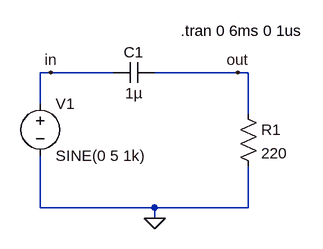
[diagram p0: schematic AC_Simulation.asc]
AC_Simulation.asc, the LTspice schematic file:
Version 4
SHEET 1 880 680
WIRE 96 112 80 112
WIRE 192 112 96 112
WIRE 384 112 256 112
WIRE 400 112 384 112
WIRE 80 160 80 112
WIRE 400 176 400 112
WIRE 80 320 80 240
WIRE 256 320 80 320
WIRE 400 320 400 256
WIRE 400 320 256 320
WIRE 256 336 256 320
FLAG 256 336 0
FLAG 96 112 in
FLAG 384 112 out
SYMBOL voltage 80 144 R0
WINDOW 123 0 0 Left 0
WINDOW 39 0 0 Left 0
SYMATTR InstName V1
SYMATTR Value SINE(0 5 1k)
SYMBOL cap 256 96 R90
WINDOW 0 0 32 VBottom 2
WINDOW 3 32 32 VTop 2
SYMATTR InstName C1
SYMATTR Value 1µ
SYMBOL res 384 160 R0
SYMATTR InstName R1
SYMATTR Value 220
TEXT 296 48 Left 2 !.tran 0 6ms 0 1us

The netlist it stands for:
* AC_Simulation.asc
V1 in 0 SINE(0 5 1k)
C1 out in 1µ
R1 out 0 220
.tran 0 6ms 0 1us
.backanno
.end